# EasyEDA schematic projet_pcb_bluepill_f103.SchDoc.json
TITLE: projet_pcb_bluepill_f103.SchDoc; REV: 1.0; Date: 2023-12-11; Sheet: 1/1; Company: ESEO_GrpB_section7
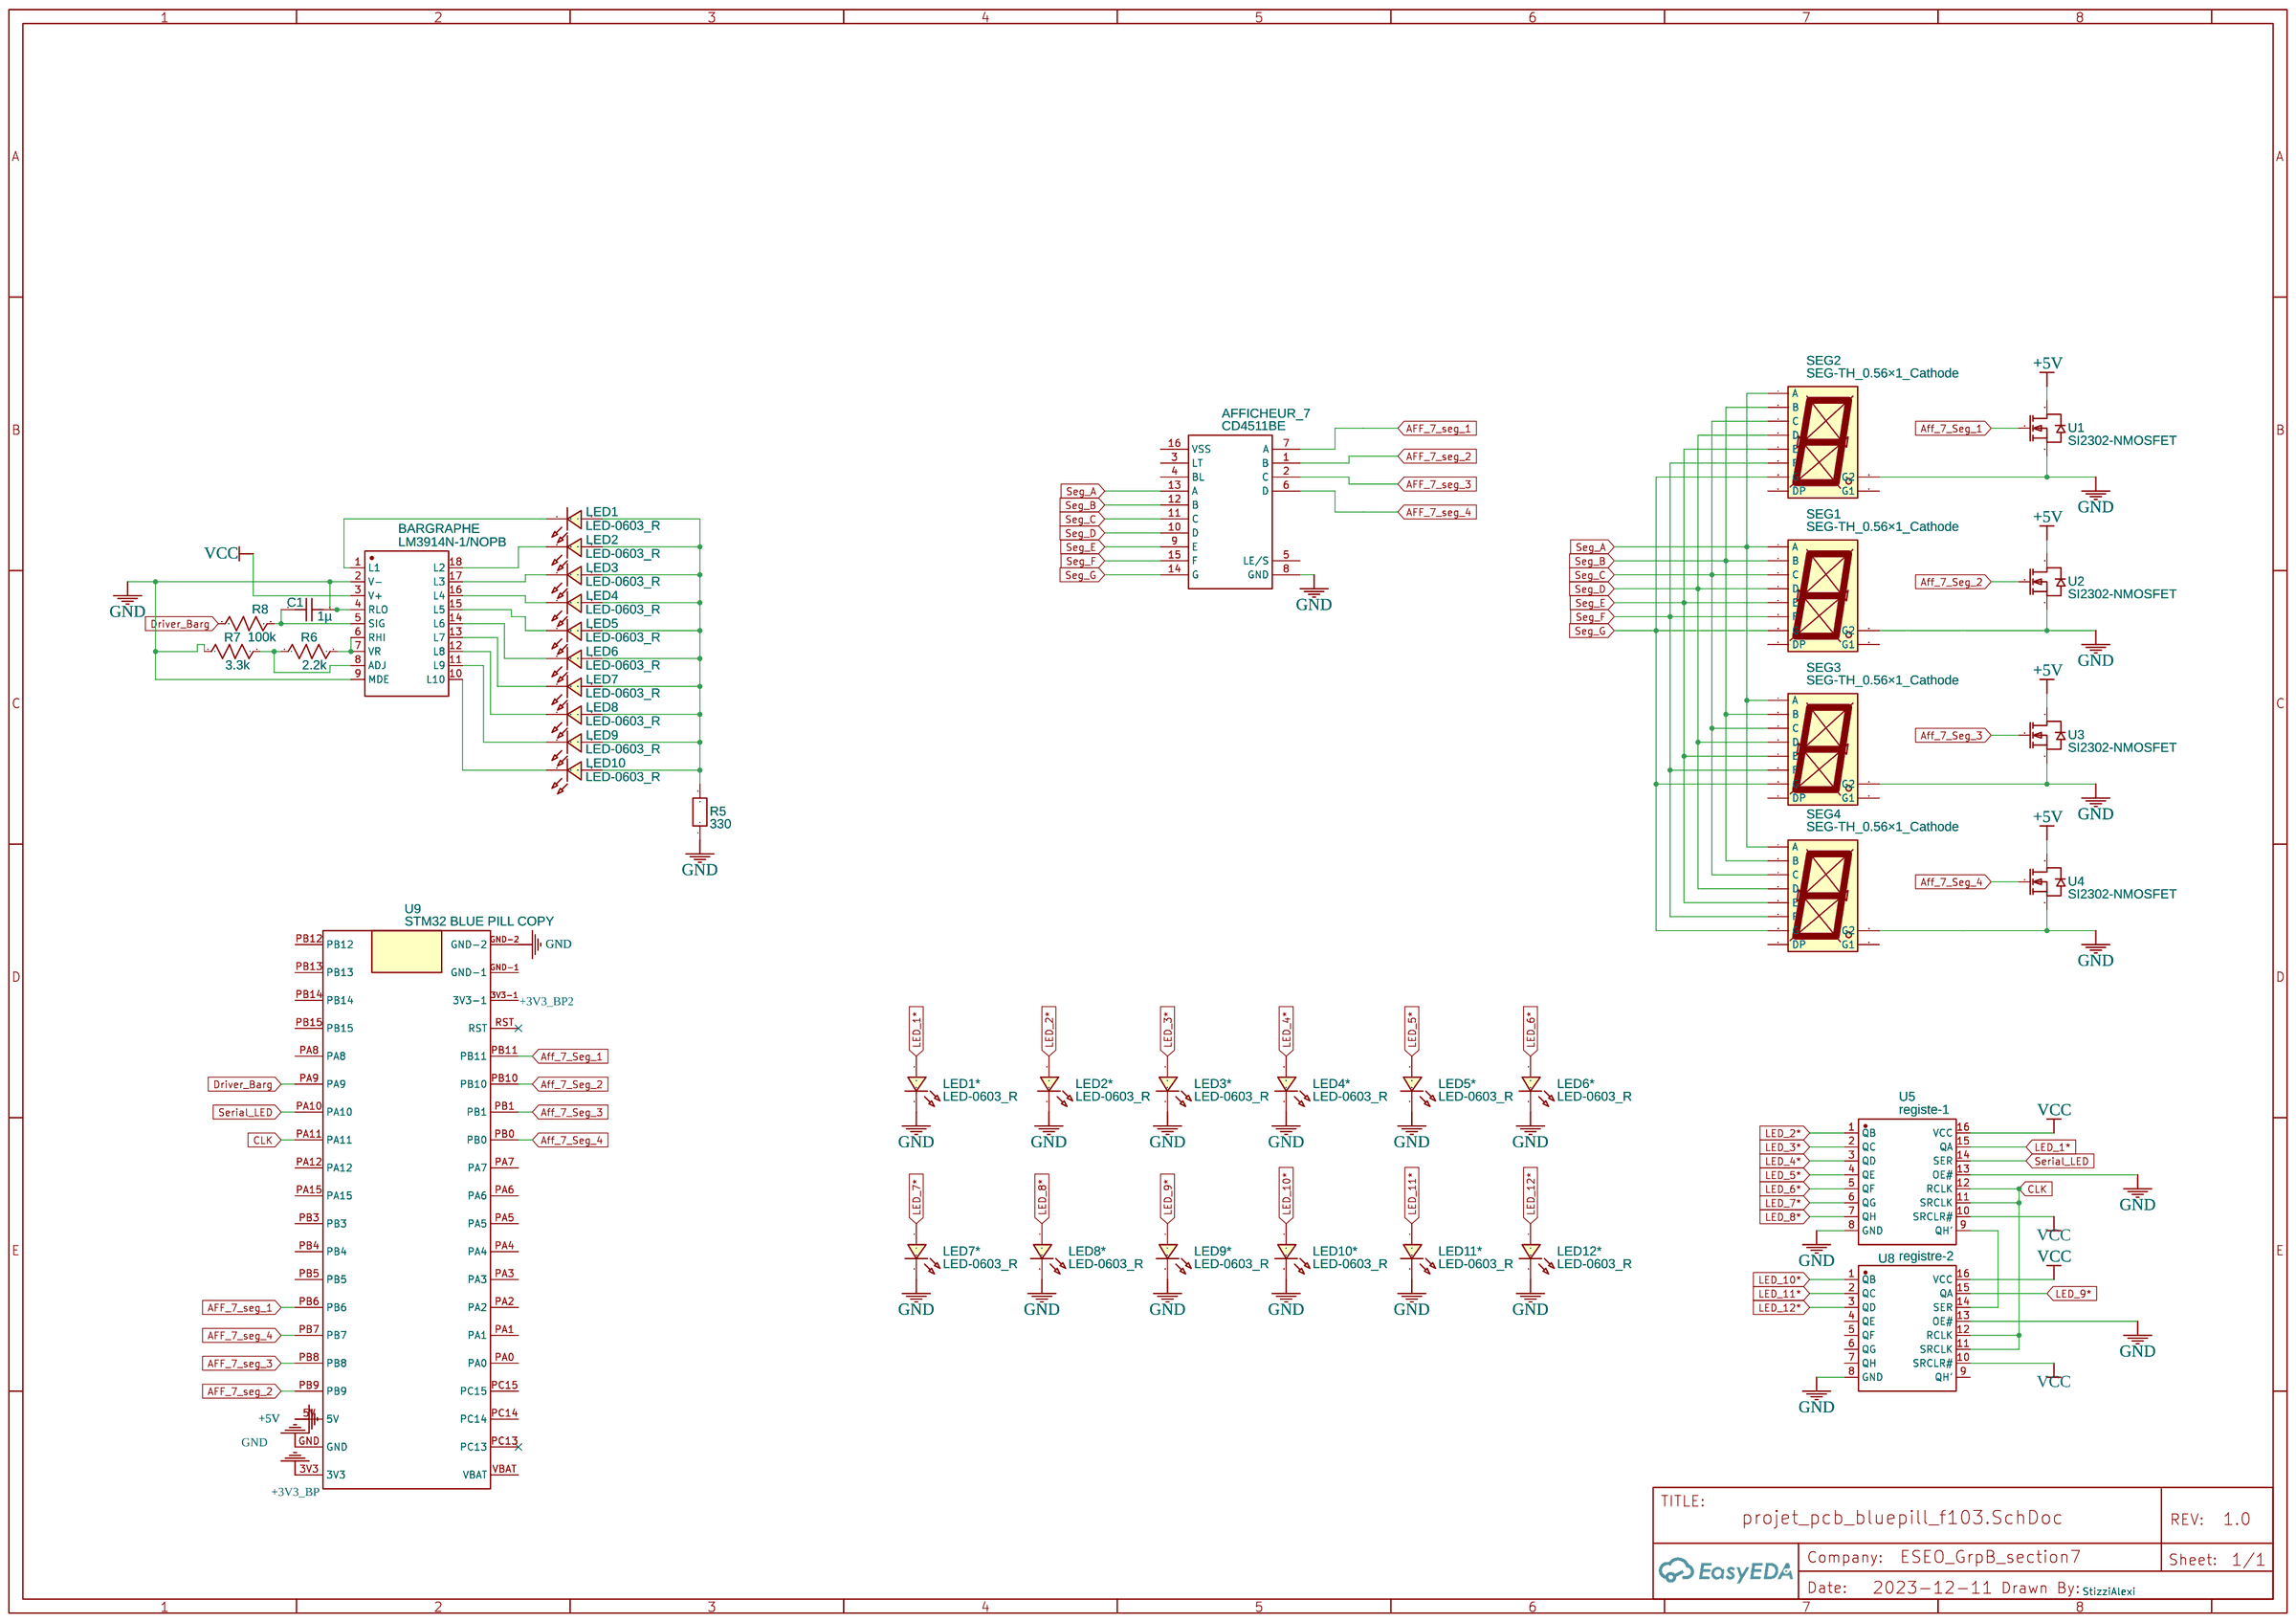
[diagram p0: schematic sheet]

## Parts
AFFICHEUR_7  CD4511BE  [DIP-16_L20.3-W10.2-P2.54-LS10.2-BL]
BARGRAPHE  LM3914N-1/NOPB  [DIP-18_L23.0-W6.5-P2.54-LS7.6-BL]
C1  1µ  [C0603]
LED1  LED-0603_R  [LED0603_RED]
LED1*  LED-0603_R  [LED0603_RED]
LED2  LED-0603_R  [LED0603_RED]
LED2*  LED-0603_R  [LED0603_RED]
LED3  LED-0603_R  [LED0603_RED]
LED3*  LED-0603_R  [LED0603_RED]
LED4  LED-0603_R  [LED0603_RED]
LED4*  LED-0603_R  [LED0603_RED]
LED5  LED-0603_R  [LED0603_RED]
LED5*  LED-0603_R  [LED0603_RED]
LED6  LED-0603_R  [LED0603_RED]
LED6*  LED-0603_R  [LED0603_RED]
LED7  LED-0603_R  [LED0603_RED]
LED7*  LED-0603_R  [LED0603_RED]
LED8  LED-0603_R  [LED0603_RED]
LED8*  LED-0603_R  [LED0603_RED]
LED9  LED-0603_R  [LED0603_RED]
LED9*  LED-0603_R  [LED0603_RED]
LED10  LED-0603_R  [LED0603_RED]
LED10*  LED-0603_R  [LED0603_RED]
LED11*  LED-0603_R  [LED0603_RED]
LED12*  LED-0603_R  [LED0603_RED]
R5  330  [R0603]
R6  2.2k  [R0603]
R7  3.3k  [R0603]
R8  100k  [R0603]
SEG1  SEG-TH_0.56×1_Cathode  [LED-SEG-TH_10P-L12.6-W19.0-P2.54-S15.24-BL]
SEG2  SEG-TH_0.56×1_Cathode  [LED-SEG-TH_10P-L12.6-W19.0-P2.54-S15.24-BL]
SEG3  SEG-TH_0.56×1_Cathode  [LED-SEG-TH_10P-L12.6-W19.0-P2.54-S15.24-BL]
SEG4  SEG-TH_0.56×1_Cathode  [LED-SEG-TH_10P-L12.6-W19.0-P2.54-S15.24-BL]
U1  SI2302-NMOSFET  [SOT-23-3_L2.9-W1.3-P1.90-LS2.4-BR]
U2  SI2302-NMOSFET  [SOT-23-3_L2.9-W1.3-P1.90-LS2.4-BR]
U3  SI2302-NMOSFET  [SOT-23-3_L2.9-W1.3-P1.90-LS2.4-BR]
U4  SI2302-NMOSFET  [SOT-23-3_L2.9-W1.3-P1.90-LS2.4-BR]
U5  registe-1  [PDIP-16_L19.3-W6.4-P2.54-LS7.9-BL]
U8  registre-2  [PDIP-16_L19.3-W6.4-P2.54-LS7.9-BL]
U9  STM32 BLUE PILL COPY  [BLUEPILL]

## Library data of the parts
AFFICHEUR_7 = CD4511BE: Contributor: tarharnak
BARGRAPHE = LM3914N-1/NOPB: Supplier: LCSC; Manufacturer: TI(德州仪器); Supplier Part: C9408; JLCPCB Part Class: Extended Part; link: https://lcsc.com/eda_search?q=C9408&%26type=1&ref=editor
C1 = C_0603_US: Contributor: LCEDA_Lib
LED1 LED1* LED2 LED2* LED3 LED3* LED4 LED4* LED5 LED5* LED6 LED6* LED7 LED7* LED8 LED8* LED9 LED9* LED10 LED10* LED11* LED12* = LED-0603_R: Manufacturer: EVERLIGHT(台湾亿光); Manufacturer Part: 19-217/R6C-AL1M2VY/3T; Supplier Part: C72044; Supplier: LCSC; Contributor: LCEDA_01
R5 = R_0603_EU: Contributor: LCEDA_Lib
R6-R8 = R_0603_US: Contributor: LCEDA_Lib
SEG1-SEG4 = SEG-TH_0.56×1_Cathode: Manufacturer: 志浩; Supplier Part: C8093; Contributor: LCEDA_01
U1-U4 = SI2302-NMOSFET: Contributor: LCSC; Supplier: LCSC; Supplier Part: C9900002167; Manufacturer: null; Manufacturer Part: si2302-nmosfet; JLCPCB Part Class: Extended Part; link: https://lcsc.com/eda_search?q=C9900002167&%26type=1&ref=editor
U5 U8 = CD74HC595E: Contributor: LCSC; Supplier: LCSC; Supplier Part: C2871902; Manufacturer: TI(德州仪器); link: https://lcsc.com/eda_search?q=C2871902&%26type=1&ref=editor
U9 = STM32 BLUE PILL COPY: link: http://wiki.stm32duino.com/index.php?title=Blue_Pill; Contributor: M2k Pcb

## Nets
+3V3_BP: U9.3V3
+5V: U1.3(D) U2.3(D) U3.3(D) U4.3(D) U9.5V
GND: AFFICHEUR_7.8(GND) BARGRAPHE.2(V-) BARGRAPHE.4(RLO) BARGRAPHE.9(MDE) C1.2 LED1*.2 LED2*.2 LED3*.2 LED4*.2 LED5*.2 LED6*.2 LED7*.2 LED8*.2 LED9*.2 LED10*.2 LED11*.2 LED12*.2 R5.1 R7.1 SEG1.8(G2) SEG2.8(G2) SEG3.8(G2) SEG4.8(G2) U1.2(S) U2.2(S) U3.2(S) U4.2(S) U5.8(GND) U5.13(OE#) U8.8(GND) U8.13(OE#) U9.GND U9.GND-2
VCC: BARGRAPHE.3(V+) U5.10(SRCLR#) U5.16(VCC) U8.10(SRCLR#) U8.16(VCC)
AFF_7_seg_1: AFFICHEUR_7.7(A) U9.PB6
Aff_7_Seg_1: U1.1(G) U9.PB11
AFF_7_seg_2: AFFICHEUR_7.1(B) U9.PB9
Aff_7_Seg_2: U2.1(G) U9.PB10
AFF_7_seg_3: AFFICHEUR_7.2(C) U9.PB8
Aff_7_Seg_3: U3.1(G) U9.PB1
AFF_7_seg_4: AFFICHEUR_7.6(D) U9.PB7
Aff_7_Seg_4: U4.1(G) U9.PB0
CLK: U5.11(SRCLK) U5.12(RCLK) U8.11(SRCLK) U8.12(RCLK) U9.PA11
Driver_Barg: R8.1 U9.PA9
LED_1*: LED1*.1 U5.15(QA)
LED_2*: LED2*.1 U5.1(QB)
LED_3*: LED3*.1 U5.2(QC)
LED_4*: LED4*.1 U5.3(QD)
LED_5*: LED5*.1 U5.4(QE)
LED_6*: LED6*.1 U5.5(QF)
LED_7*: LED7*.1 U5.6(QG)
LED_8*: LED8*.1 U5.7(QH)
LED_9*: LED9*.1 U8.15(QA)
LED_10*: LED10*.1 U8.1(QB)
LED_11*: LED11*.1 U8.2(QC)
LED_12*: LED12*.1 U8.3(QD)
Seg_A: AFFICHEUR_7.13(A) SEG1.7(A) SEG2.7(A) SEG3.7(A) SEG4.7(A)
Seg_B: AFFICHEUR_7.12(B) SEG1.6(B) SEG2.6(B) SEG3.6(B) SEG4.6(B)
Seg_C: AFFICHEUR_7.11(C) SEG1.4(C) SEG2.4(C) SEG3.4(C) SEG4.4(C)
Seg_D: AFFICHEUR_7.10(D) SEG1.2(D) SEG2.2(D) SEG3.2(D) SEG4.2(D)
Seg_E: AFFICHEUR_7.9(E) SEG1.1(E) SEG2.1(E) SEG3.1(E) SEG4.1(E)
Seg_F: AFFICHEUR_7.15(F) SEG1.9(F) SEG2.9(F) SEG3.9(F) SEG4.9(F)
Seg_G: AFFICHEUR_7.14(G) SEG1.10(G) SEG2.10(G) SEG3.10(G) SEG4.10(G)
Serial_LED: U5.14(SER) U9.PA10
Net-(BARGRAPHE-1): BARGRAPHE.1(L1) LED1.2
Net-(BARGRAPHE-5): BARGRAPHE.5(SIG) C1.1 R8.2
Net-(BARGRAPHE-6): BARGRAPHE.6(RHI) BARGRAPHE.7(VR) R6.2
Net-(BARGRAPHE-8): BARGRAPHE.8(ADJ) R6.1 R7.2
Net-(BARGRAPHE-10): BARGRAPHE.10(L10) LED10.2
Net-(BARGRAPHE-11): BARGRAPHE.11(L9) LED9.2
Net-(BARGRAPHE-12): BARGRAPHE.12(L8) LED8.2
Net-(BARGRAPHE-13): BARGRAPHE.13(L7) LED7.2
Net-(BARGRAPHE-14): BARGRAPHE.14(L6) LED6.2
Net-(BARGRAPHE-15): BARGRAPHE.15(L5) LED5.2
Net-(BARGRAPHE-16): BARGRAPHE.16(L4) LED4.2
Net-(BARGRAPHE-17): BARGRAPHE.17(L3) LED3.2
Net-(BARGRAPHE-18): BARGRAPHE.18(L2) LED2.2
Net-(LED1-1): LED1.1 LED2.1 LED3.1 LED4.1 LED5.1 LED6.1 LED7.1 LED8.1 LED9.1 LED10.1 R5.2
Net-(U5-9): U5.9(QH’) U8.14(SER)

Not connected (* = marked no-connect by the designer): AFFICHEUR_7 3(LT) 4(BL) 5(LE/S) 16(VSS); SEG1 3(G1) 5(DP); SEG2 3(G1) 5(DP); SEG3 3(G1) 5(DP); SEG4 3(G1) 5(DP); U8 4(QE) 5(QF) 6(QG) 7(QH) 9(QH’); U9 3V3-1 GND-1 PA0 PA1 PA2 PA3 PA4 PA5 PA6 PA7 PA8 PA12 PA15 PB3 PB4 PB5 PB12 PB13 PB14 PB15 PC13* PC14 PC15 RST* VBAT

## Notes on the sheet
- +3V3_BP2
